# Altium schematic sheet BTS7960.SchDoc
size A3; SheetNumber: 3; SheetTotal: 3
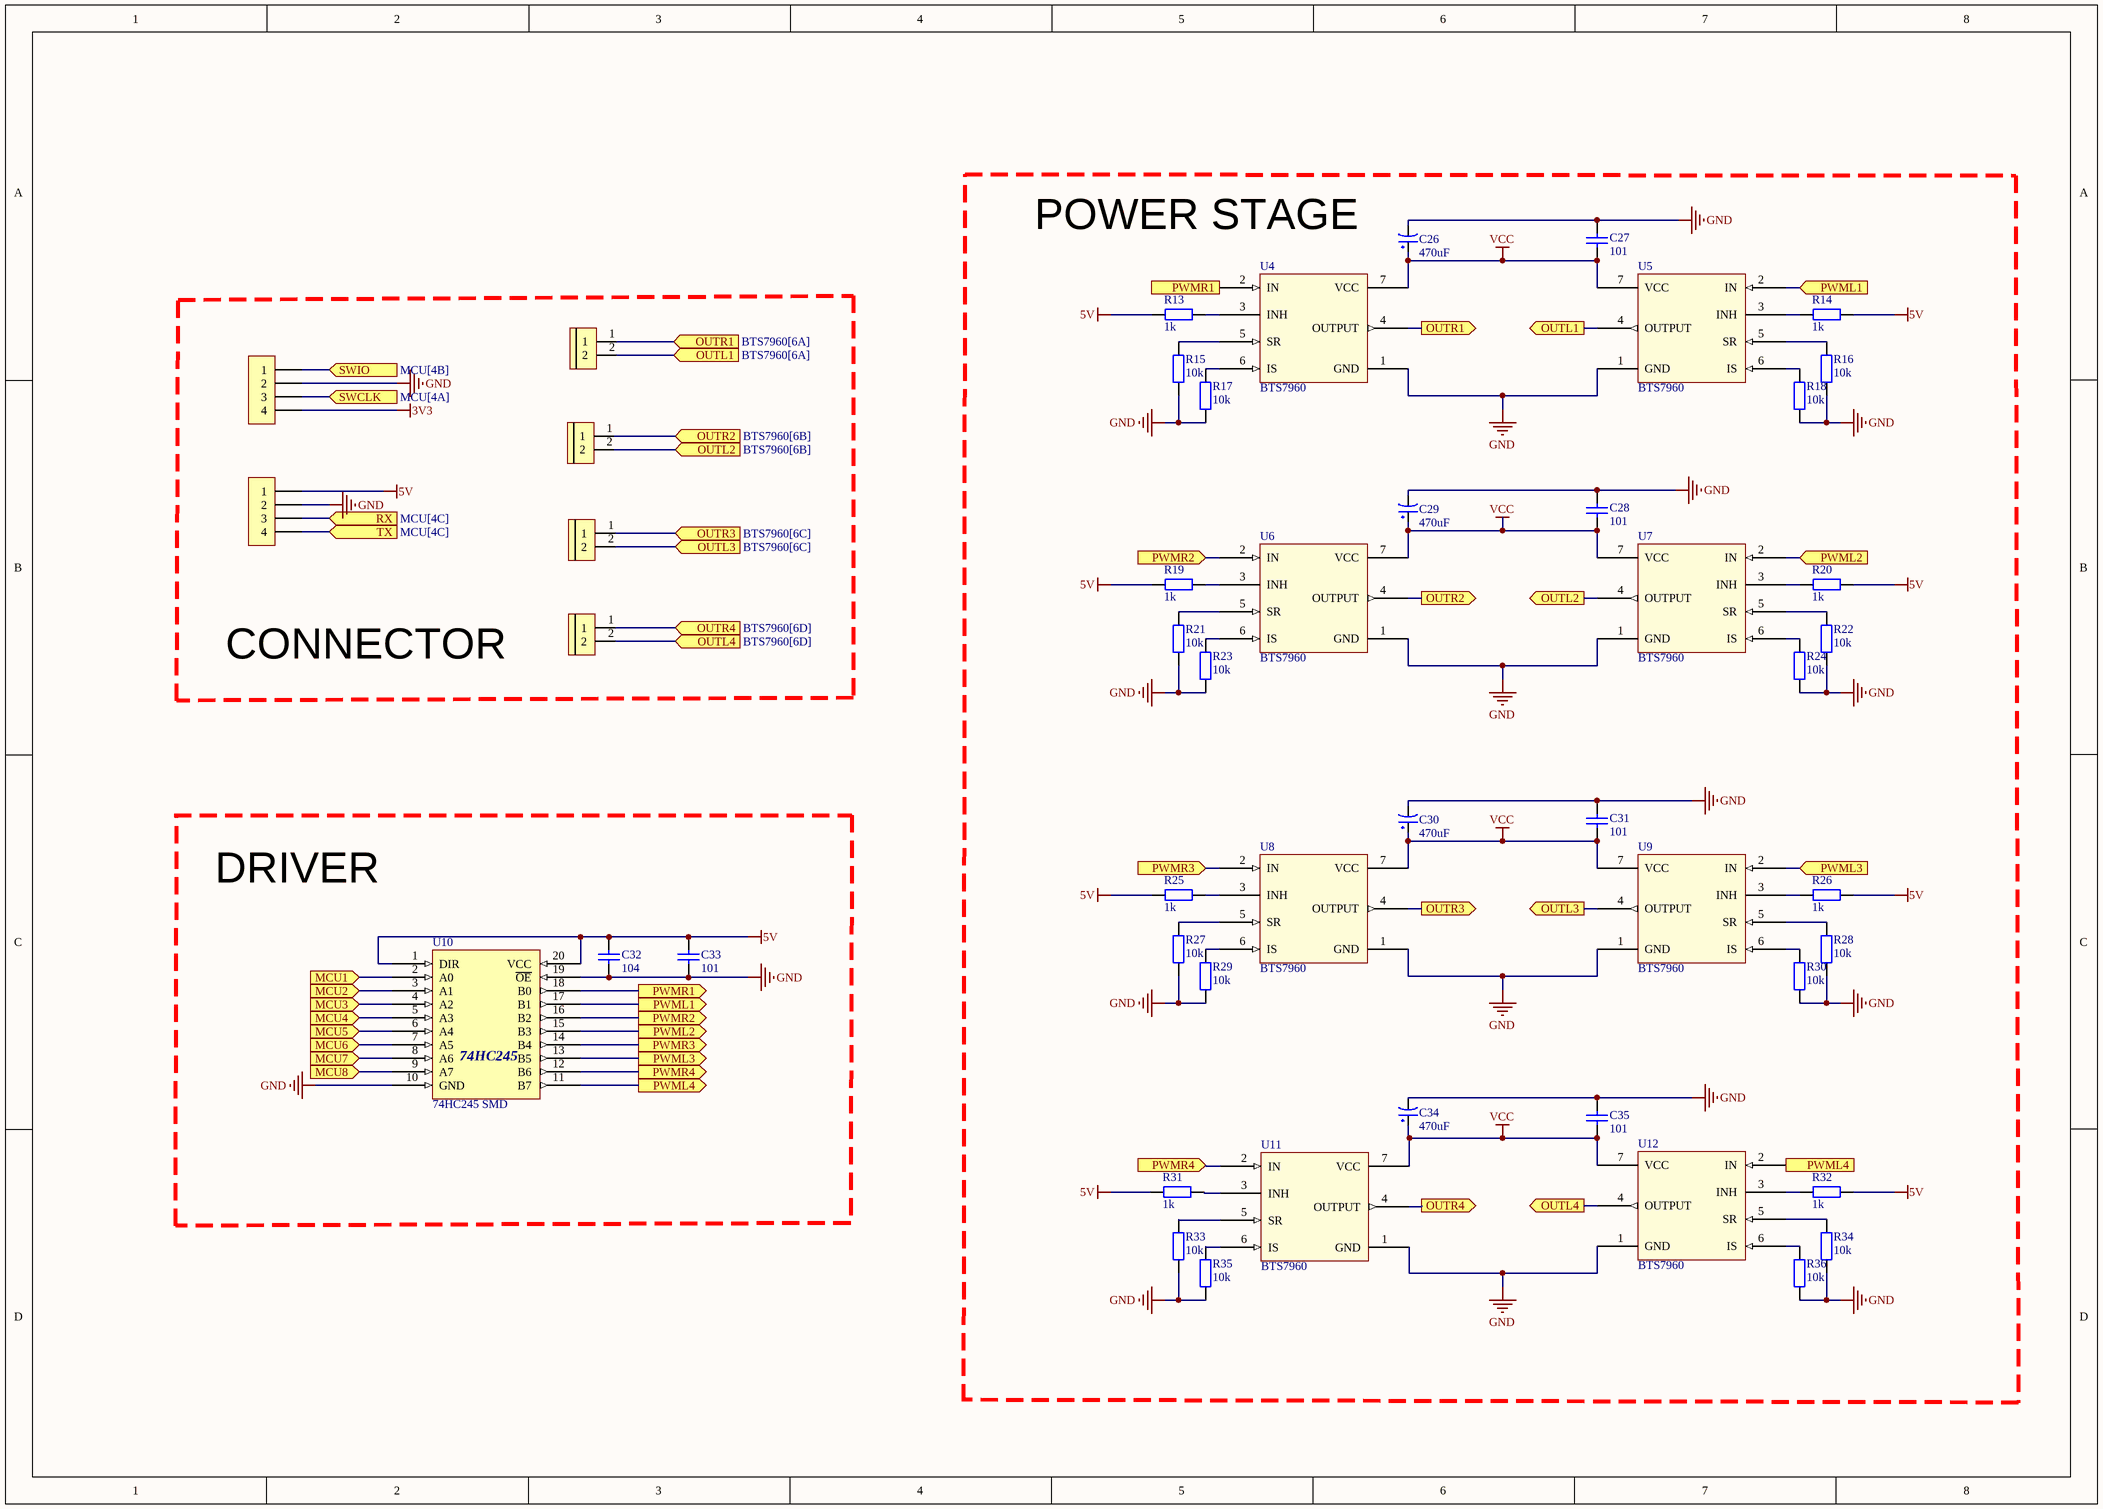
[diagram p0: BTS7960.SchDoc]

## Parts
C26  470uF  [tu hoa 8mm]
C27  101  [tu 0805]
C28  101  [tu 0805]
C29  470uF  [tu hoa 8mm]
C30  470uF  [tu hoa 8mm]
C31  101  [tu 0805]
C32  104  [tu 0805]
C33  101  [tu 0805]
C34  470uF  [tu hoa 8mm]
C35  101  [tu 0805]
H5  Header 4P 2.54 Duc Cong  [Header 4P DC 2.54]  (value not drawn)
H6  Header 4P 2.54 Duc Cong  [Header 4P DC 2.54]  (value not drawn)
KF2  CON 2 KF301  [Con 2 KF301 5.08]  (value not drawn)
KF3  CON 2 KF301  [Con 2 KF301 5.08]  (value not drawn)
KF4  CON 2 KF301  [Con 2 KF301 5.08]  (value not drawn)
KF5  CON 2 KF301  [Con 2 KF301 5.08]  (value not drawn)
R13  1k  [tro smd 0805]
R14  1k  [tro smd 0805]
R15  10k  [tro smd 0805]
R16  10k  [tro smd 0805]
R17  10k  [tro smd 0805]
R18  10k  [tro smd 0805]
R19  1k  [tro smd 0805]
R20  1k  [tro smd 0805]
R21  10k  [tro smd 0805]
R22  10k  [tro smd 0805]
R23  10k  [tro smd 0805]
R24  10k  [tro smd 0805]
R25  1k  [tro smd 0805]
R26  1k  [tro smd 0805]
R27  10k  [tro smd 0805]
R28  10k  [tro smd 0805]
R29  10k  [tro smd 0805]
R30  10k  [tro smd 0805]
R31  1k  [tro smd 0805]
R32  1k  [tro smd 0805]
R33  10k  [tro smd 0805]
R34  10k  [tro smd 0805]
R35  10k  [tro smd 0805]
R36  10k  [tro smd 0805]
U4  BTS7960  [BTS7960]
U5  BTS7960  [BTS7960]
U6  BTS7960  [BTS7960]
U7  BTS7960  [BTS7960]
U8  BTS7960  [BTS7960]
U9  BTS7960  [BTS7960]
U10  74HC245 SMD  [SOP 20]
U11  BTS7960  [BTS7960]
U12  BTS7960  [BTS7960]

## Blocks framed on the sheet
POWER STAGE: C26-C31 C34 C35 R13-R36 U4-U9 U11 U12
CONNECTOR: H5 H6 KF2-KF5
DRIVER: C32 C33 U10

## Ports
MCU1 (in, see MCU[3C]), MCU2 (in, see MCU[3B]), MCU3 (in, see MCU[3B]), MCU4 (in, see MCU[3B]), MCU5 (in, see MCU[3A]), MCU6 (in, see MCU[3A]), MCU7 (in, see MCU[3A]), MCU8 (in, see MCU[3A]), OUTL1 (in, see BTS7960[6A]), OUTL1 (out, see BTS7960[3A]), OUTL2 (in, see BTS7960[6B]), OUTL2 (out, see BTS7960[3B]), OUTL3 (in, see BTS7960[6C]), OUTL3 (out, see BTS7960[3B]), OUTL4 (in, see BTS7960[6D]), OUTL4 (out, see BTS7960[3B]), OUTR1 (in, see BTS7960[6A]), OUTR1 (out, see BTS7960[3A]), OUTR2 (in, see BTS7960[6B]), OUTR2 (out, see BTS7960[3B]), OUTR3 (in, see BTS7960[6C]), OUTR3 (out, see BTS7960[3B]), OUTR4 (in, see BTS7960[6D]), OUTR4 (out, see BTS7960[3B]), PWML1 (in, see BTS7960[3C]), PWML1 (out, see BTS7960[7A]), PWML2 (in, see BTS7960[3C]), PWML2 (out, see BTS7960[7B]), PWML3 (in, see BTS7960[3C]), PWML3 (out, see BTS7960[7C]), PWML4 (in, see BTS7960[3C]), PWML4 (out, see BTS7960[7D]), PWMR1 (in, see BTS7960[3C]), PWMR1 (out, see BTS7960[5A]), PWMR2 (in, see BTS7960[3C]), PWMR2 (out, see BTS7960[5B]), PWMR3 (in, see BTS7960[3C]), PWMR3 (out, see BTS7960[5C]), PWMR4 (in, see BTS7960[3C]), PWMR4 (out, see BTS7960[5D]), RX (in, see MCU[4C]), SWCLK (in, see MCU[4A]), SWIO (in, see MCU[4B]), TX (in, see MCU[4C])

## Nets
3V3: H5.4
5V: C32.1 C33.1 H6.1 R13.1 R14.2 R19.1 R20.2 R25.1 R26.2 R31.1 R32.2 U10.1(DIR) U10.20(VCC)
GND: C26.2 C27.1 C28.1 C29.2 C30.2 C31.1 C32.2 C33.2 C34.2 C35.1 H5.2 H6.2 R15.1 R16.1 R17.1 R18.1 R21.1 R22.1 R23.1 R24.1 R27.1 R28.1 R29.1 R30.1 R33.1 R34.1 R35.1 R36.1 U4.1(GND) U5.1(GND) U6.1(GND) U7.1(GND) U8.1(GND) U9.1(GND) U10.10(GND) U10.19(~{OE}) U11.1(GND) U12.1(GND)
VCC: C26.1 C27.2 C28.2 C29.1 C30.1 C31.2 C34.1 C35.2 U4.7(VCC) U5.7(VCC) U6.7(VCC) U7.7(VCC) U8.7(VCC) U9.7(VCC) U11.7(VCC) U12.7(VCC)
MCU1: U10.2(A0) ; port MCU1
MCU2: U10.3(A1) ; port MCU2
MCU3: U10.4(A2) ; port MCU3
MCU4: U10.5(A3) ; port MCU4
MCU5: U10.6(A4) ; port MCU5
MCU6: U10.7(A5) ; port MCU6
MCU7: U10.8(A6) ; port MCU7
MCU8: U10.9(A7) ; port MCU8
OUTL1: KF2.2 U5.4(OUTPUT) ; port OUTL1
OUTL2: KF3.2 U7.4(OUTPUT) ; port OUTL2
OUTL3: KF4.2 U9.4(OUTPUT) ; port OUTL3
OUTL4: KF5.2 U12.4(OUTPUT) ; port OUTL4
OUTR1: KF2.1 U4.4(OUTPUT) ; port OUTR1
OUTR2: KF3.1 U6.4(OUTPUT) ; port OUTR2
OUTR3: KF4.1 U8.4(OUTPUT) ; port OUTR3
OUTR4: KF5.1 U11.4(OUTPUT) ; port OUTR4
PWML1: U5.2(IN) U10.17(B1) ; port PWML1
PWML2: U7.2(IN) U10.15(B3) ; port PWML2
PWML3: U9.2(IN) U10.13(B5) ; port PWML3
PWML4: U10.11(B7) U12.2(IN) ; port PWML4
PWMR1: U4.2(IN) U10.18(B0) ; port PWMR1
PWMR2: U6.2(IN) U10.16(B2) ; port PWMR2
PWMR3: U8.2(IN) U10.14(B4) ; port PWMR3
PWMR4: U10.12(B6) U11.2(IN) ; port PWMR4
RX: H6.3 ; port RX
SWCLK: H5.3 ; port SWCLK
SWIO: H5.1 ; port SWIO
TX: H6.4 ; port TX
NetR13_2: R13.2 U4.3(INH)
NetR14_1: R14.1 U5.3(INH)
NetR15_2: R15.2 U4.5(SR)
NetR16_2: R16.2 U5.5(SR)
NetR17_2: R17.2 U4.6(IS)
NetR18_2: R18.2 U5.6(IS)
NetR19_2: R19.2 U6.3(INH)
NetR20_1: R20.1 U7.3(INH)
NetR21_2: R21.2 U6.5(SR)
NetR22_2: R22.2 U7.5(SR)
NetR23_2: R23.2 U6.6(IS)
NetR24_2: R24.2 U7.6(IS)
NetR25_2: R25.2 U8.3(INH)
NetR26_1: R26.1 U9.3(INH)
NetR27_2: R27.2 U8.5(SR)
NetR28_2: R28.2 U9.5(SR)
NetR29_2: R29.2 U8.6(IS)
NetR30_2: R30.2 U9.6(IS)
NetR31_2: R31.2 U11.3(INH)
NetR32_1: R32.1 U12.3(INH)
NetR33_2: R33.2 U11.5(SR)
NetR34_2: R34.2 U12.5(SR)
NetR35_2: R35.2 U11.6(IS)
NetR36_2: R36.2 U12.6(IS)

## Notes on the sheet
- (in symbol 74HC245 SMD) 74HC245

## Library data of the parts
C26 C29 C30 C34 = Tu Hoa 470uF 25V 8x13: Cắm; Don_Vi: Con; So_Chan: 2; Ten_Linh_Kien: Tụ Hóa 470uF 25V; Ma_Hang: MH 470uF 25V; Chung_Loai: Cắm; Kieu_Chan: *
C27 C28 C31 C33 C35 = Tu 0805 101 50V 20%: Dán; Don_Vi: Con; So_Chan: 2; Ten_Linh_Kien: Tụ 0805 101-0.1nF 50V 20%; Ma_Hang: MH002806; Chung_Loai: Dán; Kieu_Chan: *
C32 = Tu 0805 104 50V 10%: Dán; Don_Vi: Con; So_Chan: 2; Ten_Linh_Kien: Tụ 0805 104-100nF 10% 50V; Ma_Hang: MH004551; Chung_Loai: Dán; Kieu_Chan: *
H5 H6 = Header 4P 2.54 Duc Cong: Cắm; Ten_Linh_Kien: Header 4P XH2.54-4P Đực Cong; Don_Vi: Con; Ma_Hang: MH001310; Chung_Loai: Cắm
KF2-KF5 = CON 2 KF301: Cắm; Ma_Hang: MH000987; Ten_Linh_Kien: CON 2 KF301-2P 5.08MM Xanh Dương; Chung_Loai: Cắm; Ghi_Chu: *; Kieu_Chan: *; Don_Vi: Con
R13 R14 R19 R20 R25 R26 R31 R32 = Tro 0805 1% 1k: Dán; Don_Vi: Con; So_Chan: 2; Ten_Linh_Kien: Trở 0805 1% 1k; Ma_Hang: MH005468; Chung_Loai: Dán; Kieu_Chan: *
R15 R17 R18 R21-R24 R27-R30 R33-R36 = Tro 0805 1% 10k: Dán; Don_Vi: Con; So_Chan: 2; Ten_Linh_Kien: Trở 0805 1% 10k; Ma_Hang: MH005473; Chung_Loai: Dán; Kieu_Chan: *
R16 = Tro 0805 5% 10k: Dán; Don_Vi: Con; So_Chan: 2; Ten_Linh_Kien: Trở 0805 5% 10k; Ma_Hang: MH005239; Chung_Loai: Dán; Kieu_Chan: *
U10 = 74HC245 SMD: Dán; Ten_Linh_Kien: 74HC245DW SSOP20 5.2MM; Don_Vi: Con; Ma_Hang: MH003571; Ghi_Chu: *; Kieu_Chan: *; Chung_Loai: Dán